# EasyEDA Pro project ProDoc_v03_CPU6502_4Plane.epro

# Schematic v03_CPU6502_4Plane
Board Name: v03_CPU6502_4Plane; Create Date: 2024-08-20; Page Name: v03_CPU6502_4Plane; Project Name: The20c_v03; Schematic Name: v03_CPU6502_4Plane; Update Date: 2024-09-03; Company: OsoLabs.tech; Drawn: OsoLabs; Page Size: A4; Part Number: v03_CPU6502_4Plane; Reviewed: OsoLabs; Version: V03
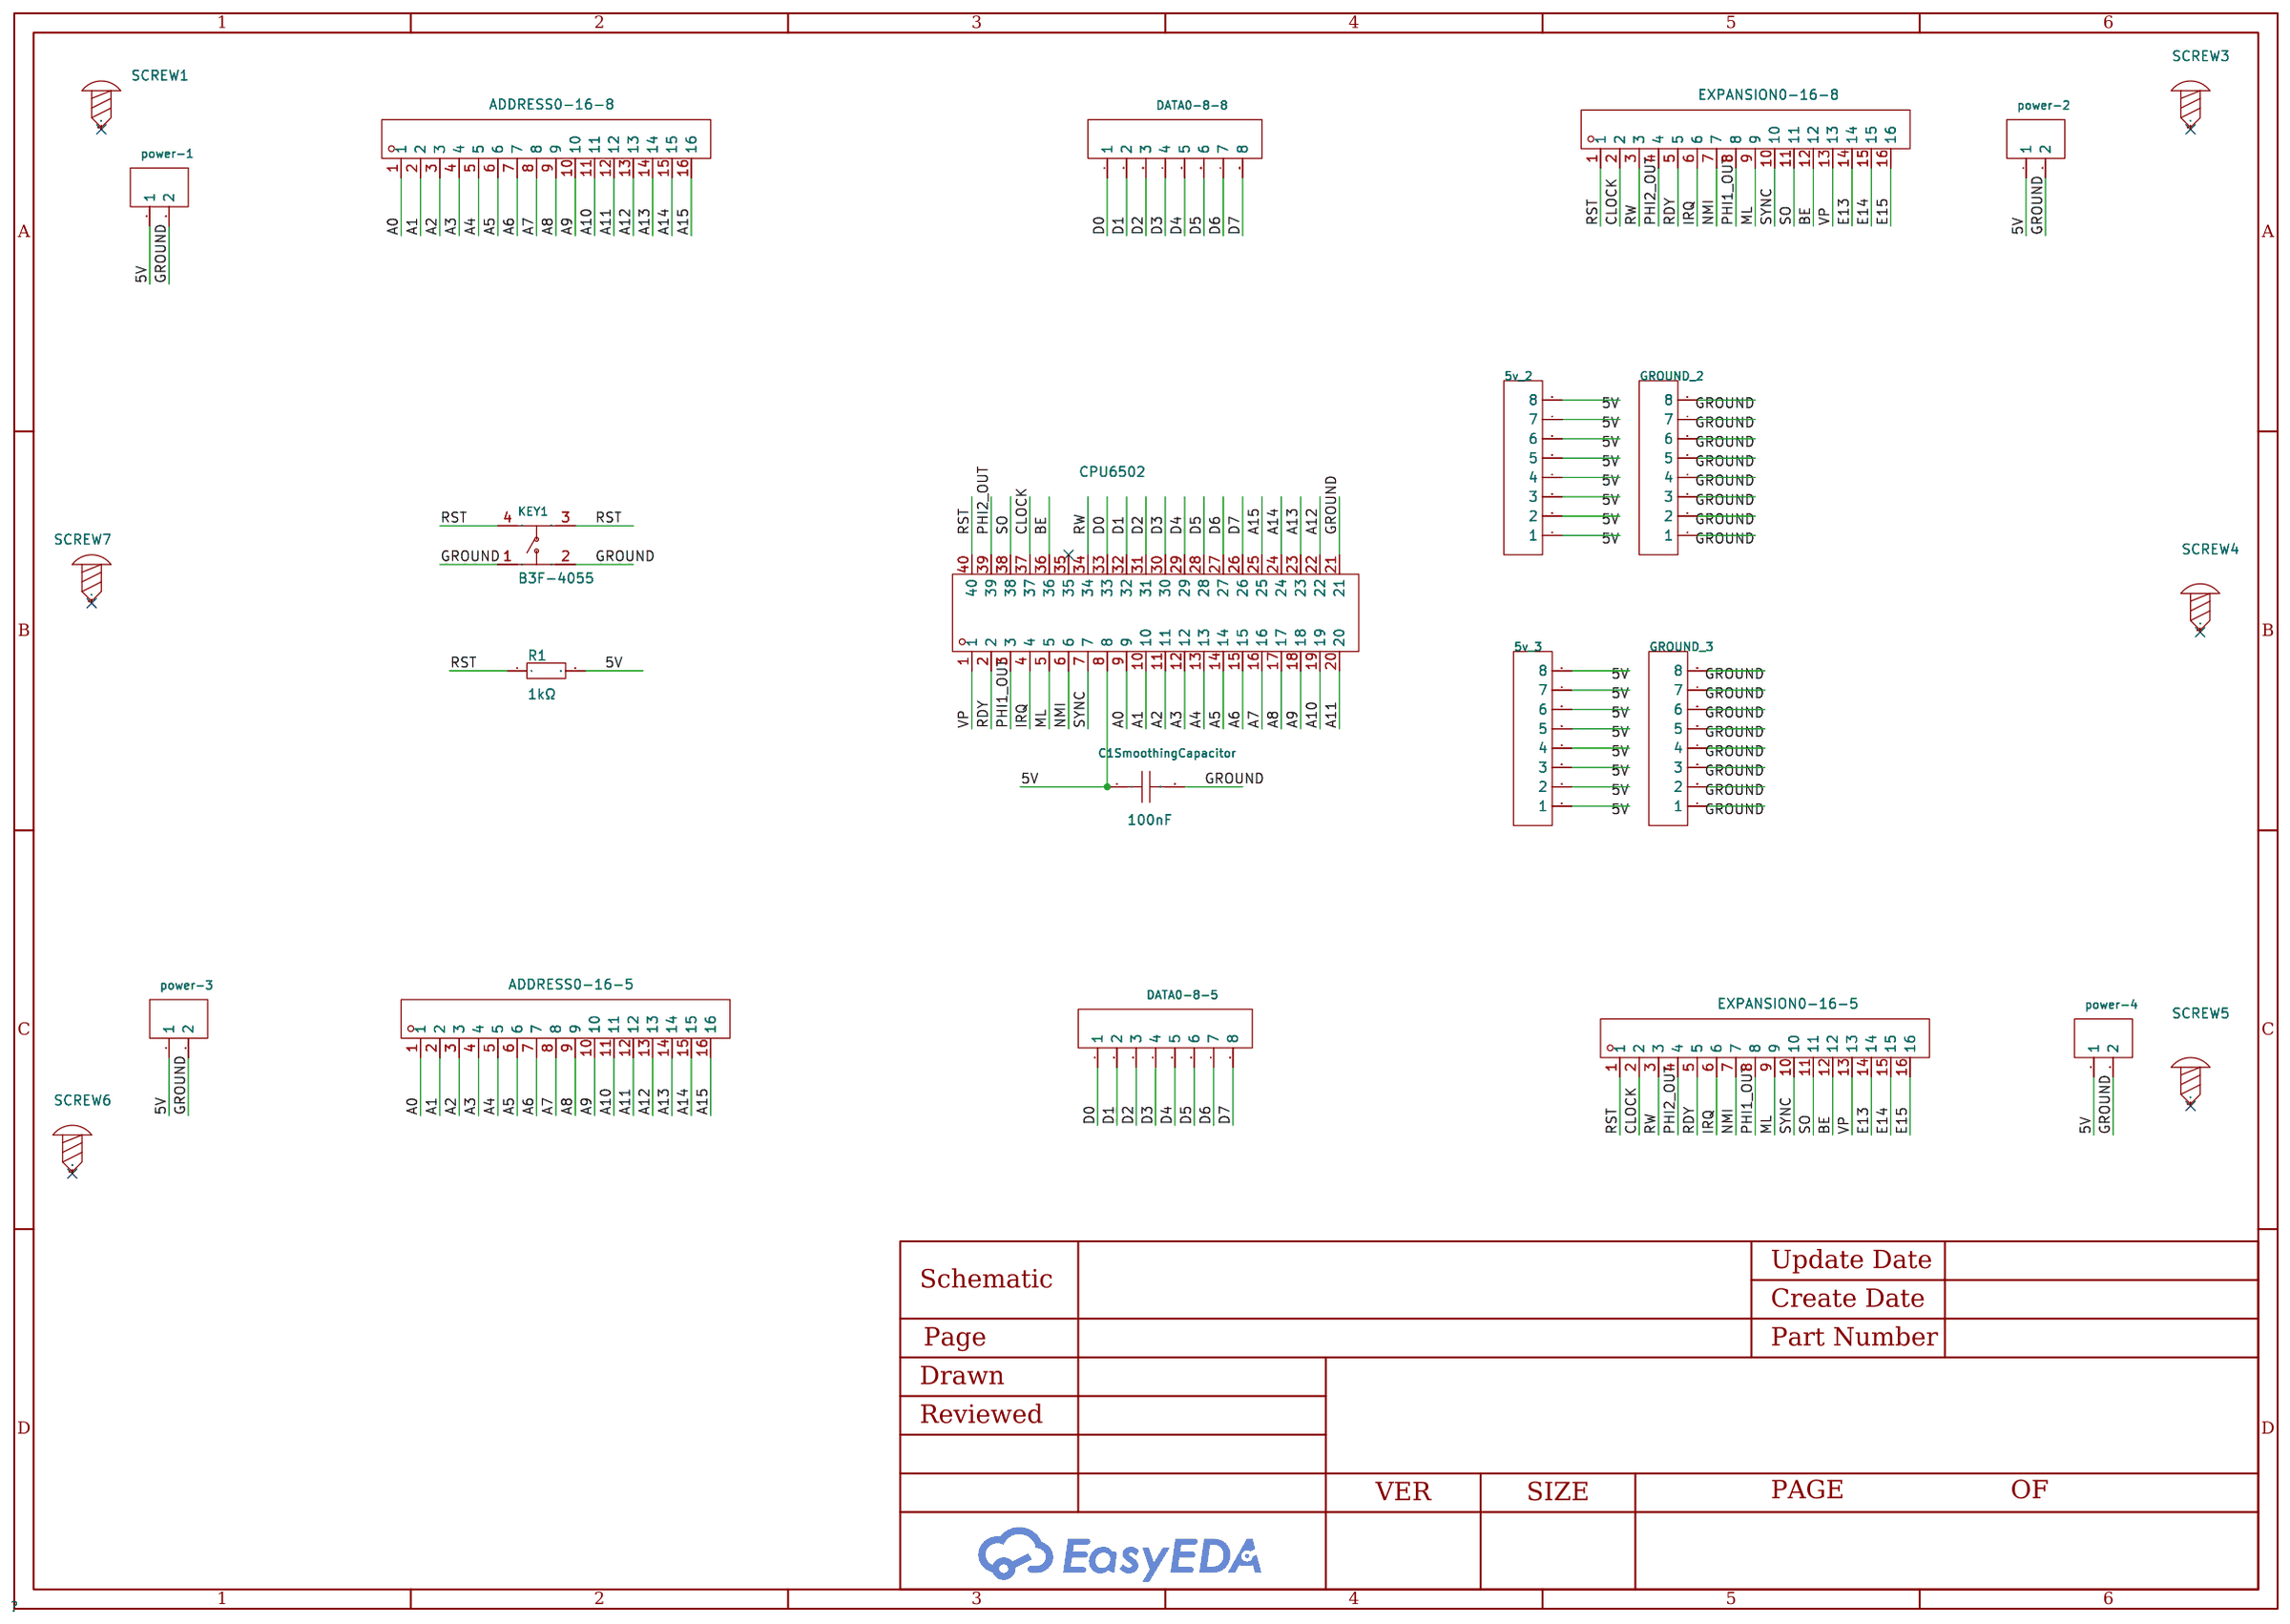
[diagram p0: schematic sheet]

## Parts
5v_2  2.54-1*8P母环保  [HDR-TH_8P-P2.54-V-F-1]
5v_3  2.54-1*8P母环保  [HDR-TH_8P-P2.54-V-F-1]
ADDRESS0-16-5  PM254-1-16-Z-8.5  [HDR-TH_16P-P2.54-V-F-A]
ADDRESS0-16-8  PM254-1-16-Z-8.5  [HDR-TH_16P-P2.54-V-F-A]
C1SmoothingCapacitor  100nF  [CAP-TH_L5.8-W2.4-P2.54-D0.6]
CPU6502  IC座-40P  [DIP-40_L50.8-W17.8-P2.54-LS15.2-BL]
DATA0-8-5  2.54-1*8P母环保  [HDR-TH_8P-P2.54-V-F-1]
DATA0-8-8  2.54-1*8P母环保  [HDR-TH_8P-P2.54-V-F-1]
EXPANSION0-16-5  PM254-1-16-Z-8.5  [HDR-TH_16P-P2.54-V-F-A]
EXPANSION0-16-8  PM254-1-16-Z-8.5  [HDR-TH_16P-P2.54-V-F-A]
GROUND_2  2.54-1*8P母环保  [HDR-TH_8P-P2.54-V-F-1]
GROUND_3  2.54-1*8P母环保  [HDR-TH_8P-P2.54-V-F-1]
KEY1  B3F-4055  [KEY-TH_4P-L12.0-W12.0-P5.00-LS13.4-EH]
power-1  2.54-1*2P母  [HDR-TH_2P-P2.54-V-F]
power-2  2.54-1*2P母  [HDR-TH_2P-P2.54-V-F]
power-3  2.54-1*2P母  [HDR-TH_2P-P2.54-V-F]
power-4  2.54-1*2P母  [HDR-TH_2P-P2.54-V-F]
R1  1kΩ  [RES-TH_BD2.7-L6.2-P10.20-D0.4]
SCREW1  -  [Screw-Hole-M3]
SCREW3  -  [Screw-Hole-M3]
SCREW4  -  [Screw-Hole-M3]
SCREW5  -  [Screw-Hole-M3]
SCREW6  -  [Screw-Hole-M3]
SCREW7  -  [Screw-Hole-M3]

## Library data of the parts
5v_2 5v_3 DATA0-8-5 DATA0-8-8 GROUND_2 GROUND_3 = 2.54-1*8P母环保: Holes Structure:1x8P Pitch:2.54mm Row Spacing:- Mounting Type:Straight Number of Rows:Plugin Number of Holes:8P Insulation Height:- Contact Material:- Contact Plating:-; LCSC Part Name: 间距:2.54mm 1x8P 直插; Supplier Part: C27438; Manufacturer: BOOMELE(博穆精密); Supplier Footprint: 插件,P=2.54mm; JLCPCB Part Class: Extended Part; Datasheet: https://atta.szlcsc.com/upload/public/pdf/source/20231221/1CA800C6799ED97958773716FAA1BFFE.pdf; Supplier: LCSC; Holes Structure: 1x8P; Pitch: 2.54mm; Mounting Type: Straight; Number of Rows: Plugin; Number of Holes: 8P
ADDRESS0-16-5 ADDRESS0-16-8 EXPANSION0-16-5 EXPANSION0-16-8 = PM254-1-16-Z-8.5: Holes Structure:1x16P Pitch:2.54mm Row Spacing:- Circular Hole / Square Hole:Square Holes Mounting Type:Straight Number of Rows:Plugin Number of Holes:16P Current Rating (Max):3A Voltage Rating (Max):- Holes Direction:Top Insulation Height:8.5mm Contact M; LCSC Part Name: 1x16P 间距:2.54mm 直插; Supplier Part: C2897379; Manufacturer: HCTL(华灿天禄); Supplier Footprint: 插件,P=2.54mm; JLCPCB Part Class: Extended Part; Datasheet: https://atta.szlcsc.com/upload/public/pdf/source/20230609/534BE42964C679BDE98E061007C4ABD6.pdf; Supplier: LCSC; Holes Structure: 1x16P; Pitch: 2.54mm; Circular Hole / Square Hole: Square Holes; Mounting Type: Straight; Number of Rows: Plugin; Number of Holes: 16P; Current Rating (Max): 3A; Holes Direction: Top; Insulation Height: 8.5mm; Contact Material: Copper Alloy; Operating Temperature Range: -40℃~+105℃; Soldering Temperature(Max): 260℃@5S
C1SmoothingCapacitor = CC1H104ZA1ED3F5P1100: Capacitance:100nF Tolerance:-20%~+80% Tolerance:-20%~+80% Voltage Rated: Lead Spacing: Temperature Coefficient: φD: Body Thickness:2.4mm; LCSC Part Name: 100nF -20%~+80% 50V; Supplier Part: C2832506; Manufacturer: Dersonic(德尔创); Supplier Footprint: 插件,P=2.54mm; JLCPCB Part Class: Extended Part; Datasheet: https://atta.szlcsc.com/upload/public/pdf/source/20211027/619020FDD8EBC9BBFCA73A5584FA164D.pdf; Supplier: LCSC; Tolerance: -20%~+80%; Body Thickness: 2.4mm
CPU6502 = IC座-40P: IC Type:DIP Pitch:2.54mm Row Spacing:15.24mm Number of Positions:40P Contact Plating:-; LCSC Part Name: 间距2.54mm P数:40P; Supplier Part: C2332; Manufacturer: BOOMELE(博穆精密); Supplier Footprint: DIP-40; JLCPCB Part Class: Extended Part; Datasheet: https://atta.szlcsc.com/upload/public/pdf/source/20151118/1457707579760.pdf; Supplier: LCSC; IC Type: DIP; Pitch: 2.54mm; Row Spacing: 15.24mm; Number of Positions: 40P
KEY1 = B3F-4055_C84931: Circuit:SPST Actuator Style:Rectangle button Mounting Style:Straight Switch Length:12mm Switch Width:12mm Switch Height:7.3mm Contact Current:50mA Voltage Rating (DC):24V With Lamp:- Mechanical Life:-; LCSC Part Name: 12*12*7.3mm 直插 轻触开关; Supplier Part: C84931; Manufacturer: OMRON(欧姆龙); Supplier Footprint: 插件; JLCPCB Part Class: Extended Part; Datasheet: https://atta.szlcsc.com/upload/public/pdf/source/20170810/C93157_1502335414592880008.pdf; Supplier: LCSC; Circuit: SPST; Actuator Style: Rectangle button; Mounting Style: Straight; Switch Length: 12mm; Switch Width: 12mm; Switch Height: 7.3mm; Contact Current: 50mA; Voltage Rating (DC): 24V
power-1-power-4 = 2.54-1*2P母: Holes Structure:1x2P Pitch:2.54mm Row Spacing:- Mounting Type:Straight Number of Rows:Plugin Number of Holes:2P Insulation Height:- Contact Material:- Contact Plating:-; LCSC Part Name: 间距:2.54mm 1x2P 直插; Supplier Part: C49661; Manufacturer: BOOMELE(博穆精密); Supplier Footprint: 插件,P=2.54mm; JLCPCB Part Class: Extended Part; Datasheet: https://atta.szlcsc.com/upload/public/pdf/source/20210301/C2718488_F4427B881E42CAA8DDB0B1C12B3A522C.pdf; Supplier: LCSC; Holes Structure: 1x2P; Pitch: 2.54mm; Mounting Type: Straight; Number of Rows: Plugin; Number of Holes: 2P
R1 = CR1/4W-1K±5%-ST26: Type:Carbon Resister Resistance: Tolerance:±5% Tolerance:±5% Overload Voltage (Max):250V Power(Watts):250mW Temperature Coefficient:±350ppm/℃ Temperature Coefficient:±350ppm/℃ Operating Temperature Range:-55℃~+155℃ Operating Temperature Range:-55℃~+155℃; LCSC Part Name: 碳膜电阻 1kΩ ±5% 250mW; Supplier Part: C2894606; Manufacturer: VO(翔胜); Supplier Footprint: 插件,2.7x6.2mm; JLCPCB Part Class: Extended Part; Datasheet: https://atta.szlcsc.com/upload/public/pdf/source/20210803/C2857407_45FF53FE186CAB545115AD37303966CD.pdf; Supplier: LCSC; Type: Carbon Resister; Tolerance: ±5%; Overload Voltage (Max): 250V; Power(Watts): 250mW; Temperature Coefficient: ±350ppm/℃; Operating Temperature Range: -55℃~+155℃
SCREW1 SCREW3-SCREW7 = Screw-Hole-M3: Supplier Footprint: 插件

## Nets
5V: 5v_2.1 5v_2.2 5v_2.3 5v_2.4 5v_2.5 5v_2.6 5v_2.7 5v_2.8 5v_3.1 5v_3.2 5v_3.3 5v_3.4 5v_3.5 5v_3.6 5v_3.7 5v_3.8 C1SmoothingCapacitor.1 CPU6502.8 power-1.1 power-2.1 power-3.1 power-4.1 R1.2
A0: ADDRESS0-16-5.1 ADDRESS0-16-8.1 CPU6502.9
A1: ADDRESS0-16-5.2 ADDRESS0-16-8.2 CPU6502.10
A2: ADDRESS0-16-5.3 ADDRESS0-16-8.3 CPU6502.11
A3: ADDRESS0-16-5.4 ADDRESS0-16-8.4 CPU6502.12
A4: ADDRESS0-16-5.5 ADDRESS0-16-8.5 CPU6502.13
A5: ADDRESS0-16-5.6 ADDRESS0-16-8.6 CPU6502.14
A6: ADDRESS0-16-5.7 ADDRESS0-16-8.7 CPU6502.15
A7: ADDRESS0-16-5.8 ADDRESS0-16-8.8 CPU6502.16
A8: ADDRESS0-16-5.9 ADDRESS0-16-8.9 CPU6502.17
A9: ADDRESS0-16-5.10 ADDRESS0-16-8.10 CPU6502.18
A10: ADDRESS0-16-5.11 ADDRESS0-16-8.11 CPU6502.19
A11: ADDRESS0-16-5.12 ADDRESS0-16-8.12 CPU6502.20
A12: ADDRESS0-16-5.13 ADDRESS0-16-8.13 CPU6502.22
A13: ADDRESS0-16-5.14 ADDRESS0-16-8.14 CPU6502.23
A14: ADDRESS0-16-5.15 ADDRESS0-16-8.15 CPU6502.24
A15: ADDRESS0-16-5.16 ADDRESS0-16-8.16 CPU6502.25
BE: CPU6502.36 EXPANSION0-16-5.12 EXPANSION0-16-8.12
CLOCK: CPU6502.37 EXPANSION0-16-5.2 EXPANSION0-16-8.2
D0: CPU6502.33 DATA0-8-5.1 DATA0-8-8.1
D1: CPU6502.32 DATA0-8-5.2 DATA0-8-8.2
D2: CPU6502.31 DATA0-8-5.3 DATA0-8-8.3
D3: CPU6502.30 DATA0-8-5.4 DATA0-8-8.4
D4: CPU6502.29 DATA0-8-5.5 DATA0-8-8.5
D5: CPU6502.28 DATA0-8-5.6 DATA0-8-8.6
D6: CPU6502.27 DATA0-8-5.7 DATA0-8-8.7
D7: CPU6502.26 DATA0-8-5.8 DATA0-8-8.8
E13: EXPANSION0-16-5.14 EXPANSION0-16-8.14
E14: EXPANSION0-16-5.15 EXPANSION0-16-8.15
E15: EXPANSION0-16-5.16 EXPANSION0-16-8.16
GROUND: C1SmoothingCapacitor.2 CPU6502.21 GROUND_2.1 GROUND_2.2 GROUND_2.3 GROUND_2.4 GROUND_2.5 GROUND_2.6 GROUND_2.7 GROUND_2.8 GROUND_3.1 GROUND_3.2 GROUND_3.3 GROUND_3.4 GROUND_3.5 GROUND_3.6 GROUND_3.7 GROUND_3.8 KEY1.1 KEY1.2 power-1.2 power-2.2 power-3.2 power-4.2
IRQ: CPU6502.4 EXPANSION0-16-5.6 EXPANSION0-16-8.6
ML: CPU6502.5 EXPANSION0-16-5.9 EXPANSION0-16-8.9
NMI: CPU6502.6 EXPANSION0-16-5.7 EXPANSION0-16-8.7
PHI1_OUT: CPU6502.3 EXPANSION0-16-5.8 EXPANSION0-16-8.8
PHI2_OUT: CPU6502.39 EXPANSION0-16-5.4 EXPANSION0-16-8.4
RDY: CPU6502.2 EXPANSION0-16-5.5 EXPANSION0-16-8.5
RST: CPU6502.40 EXPANSION0-16-5.1 EXPANSION0-16-8.1 KEY1.3 KEY1.4 R1.1
RW: CPU6502.34 EXPANSION0-16-5.3 EXPANSION0-16-8.3
SO: CPU6502.38 EXPANSION0-16-5.11 EXPANSION0-16-8.11
SYNC: CPU6502.7 EXPANSION0-16-5.10 EXPANSION0-16-8.10
VP: CPU6502.1 EXPANSION0-16-5.13 EXPANSION0-16-8.13

Not connected (* = marked no-connect by the designer): CPU6502 35*; SCREW1 1*; SCREW3 1*; SCREW4 1*; SCREW5 1*; SCREW6 1*; SCREW7 1*

# Board v03_CPU6502_4Plane
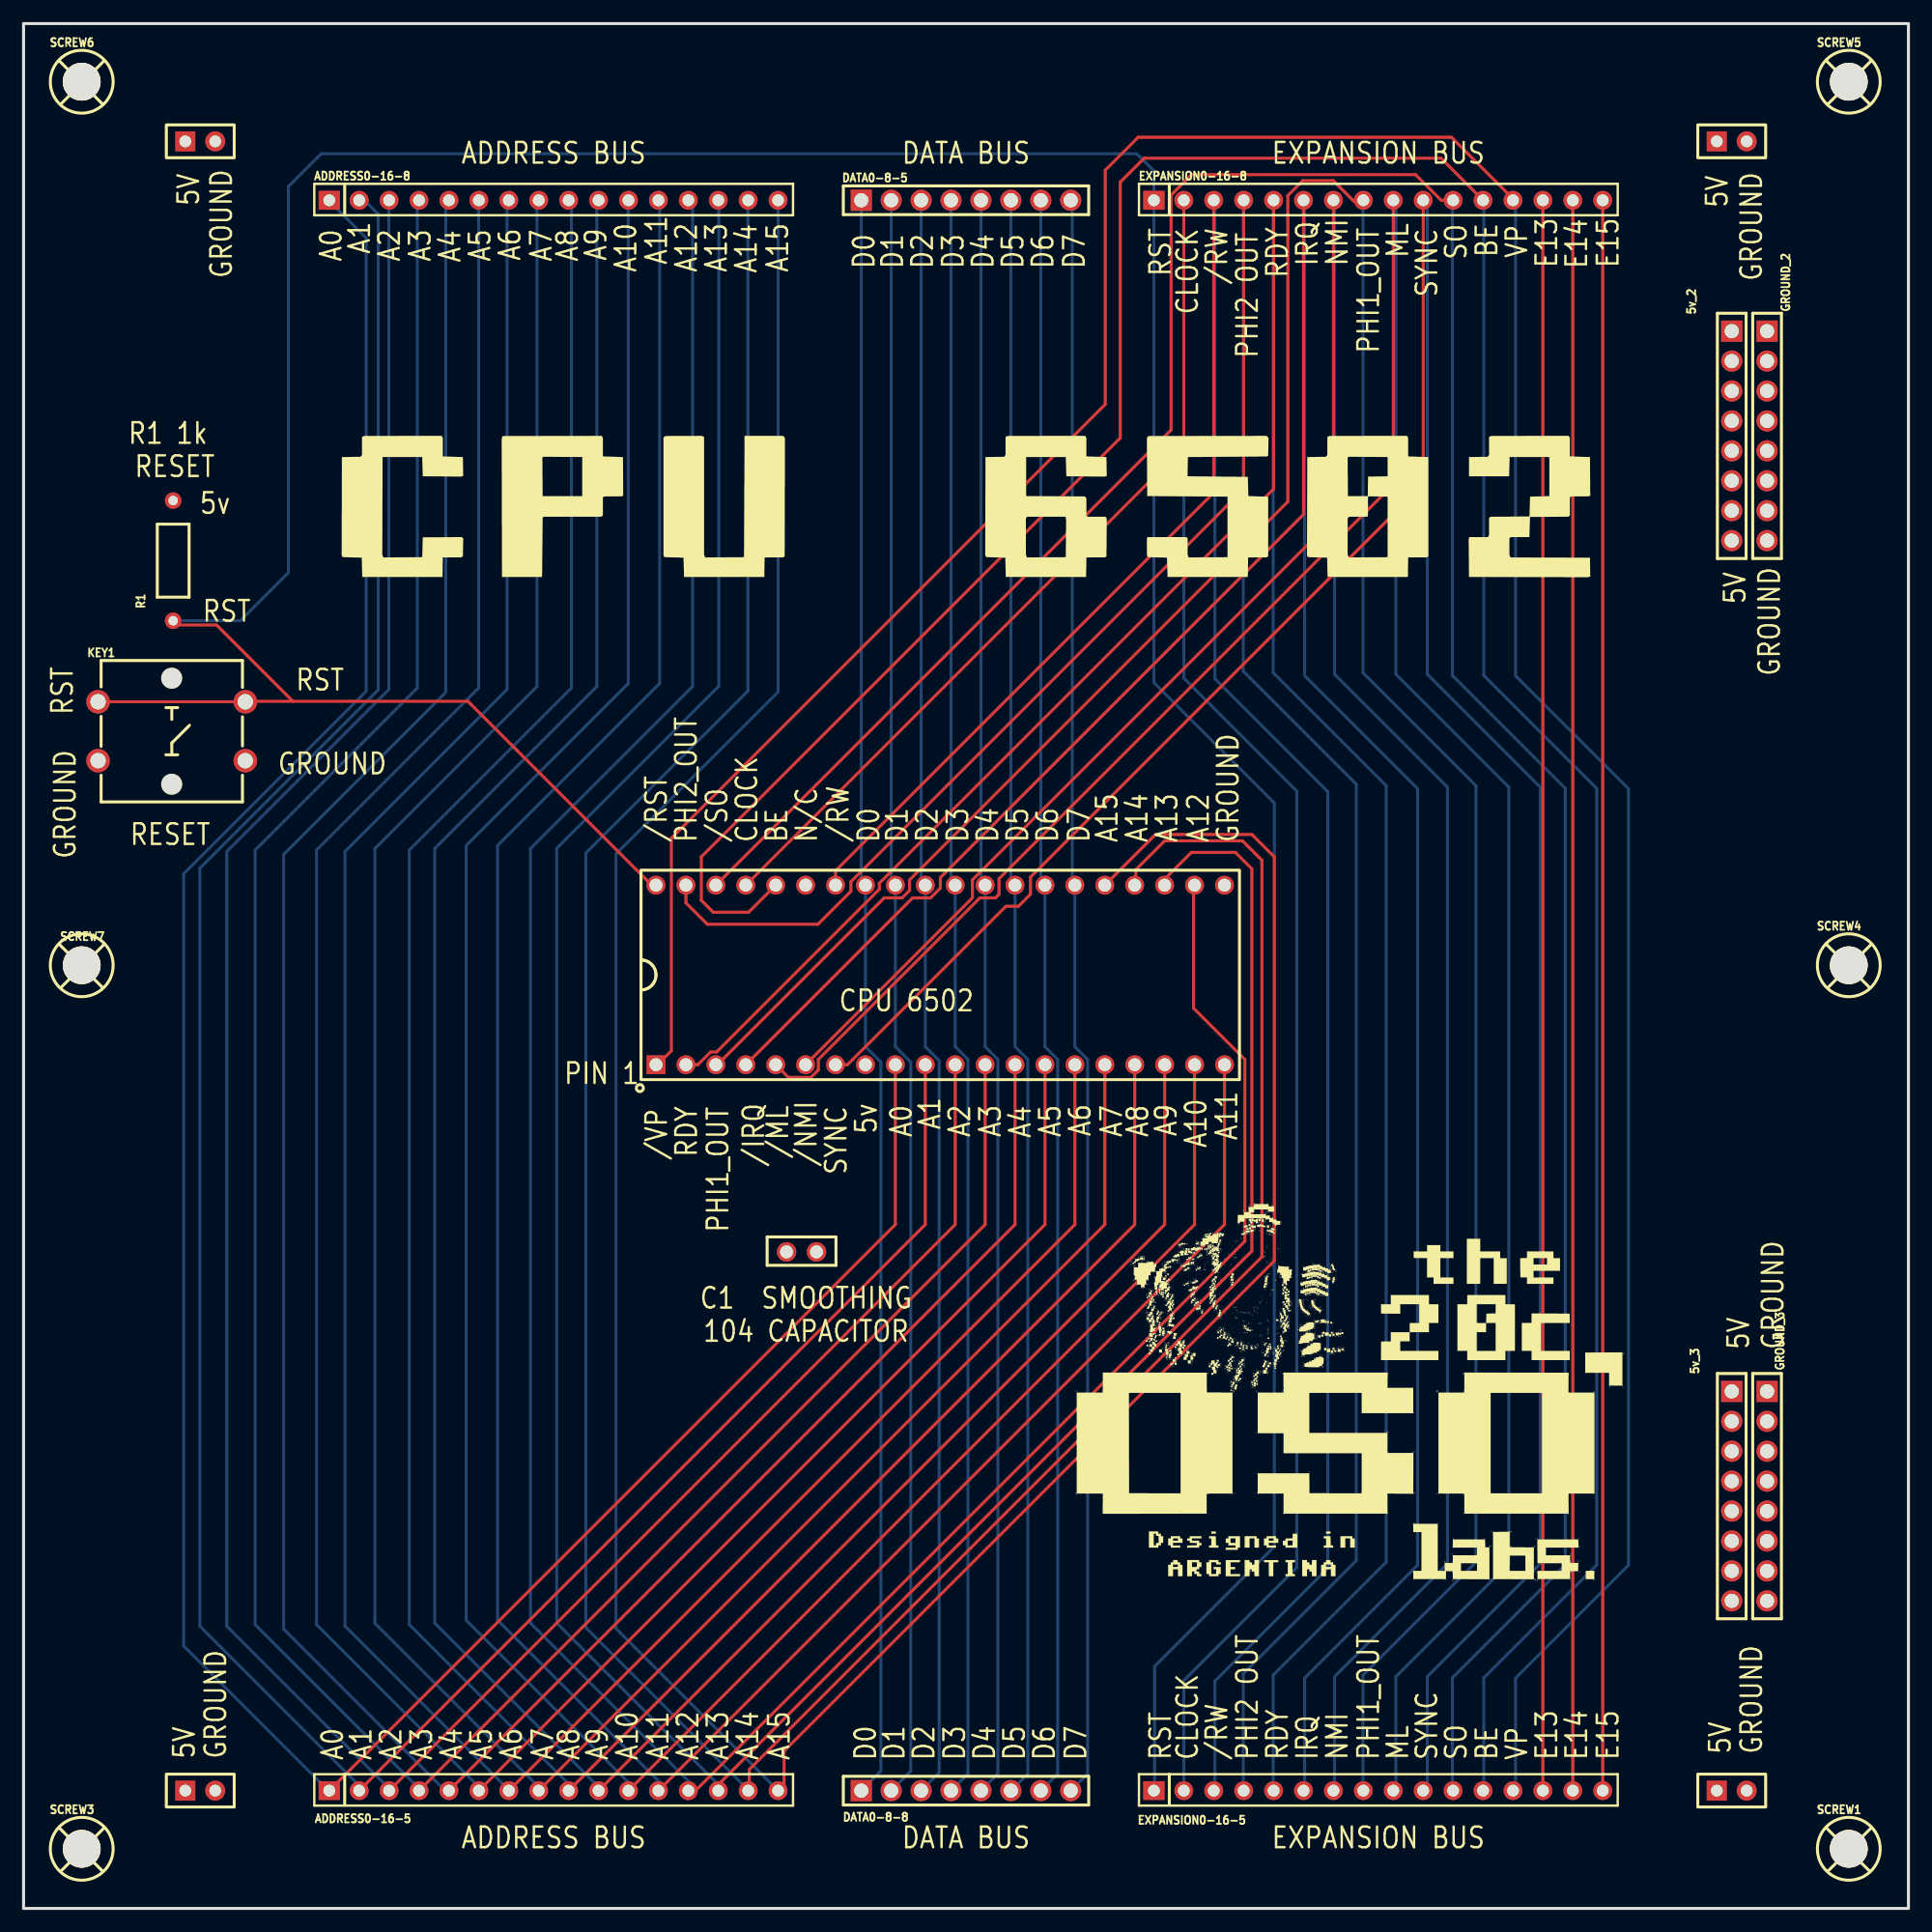
[diagram p1: board, top side]
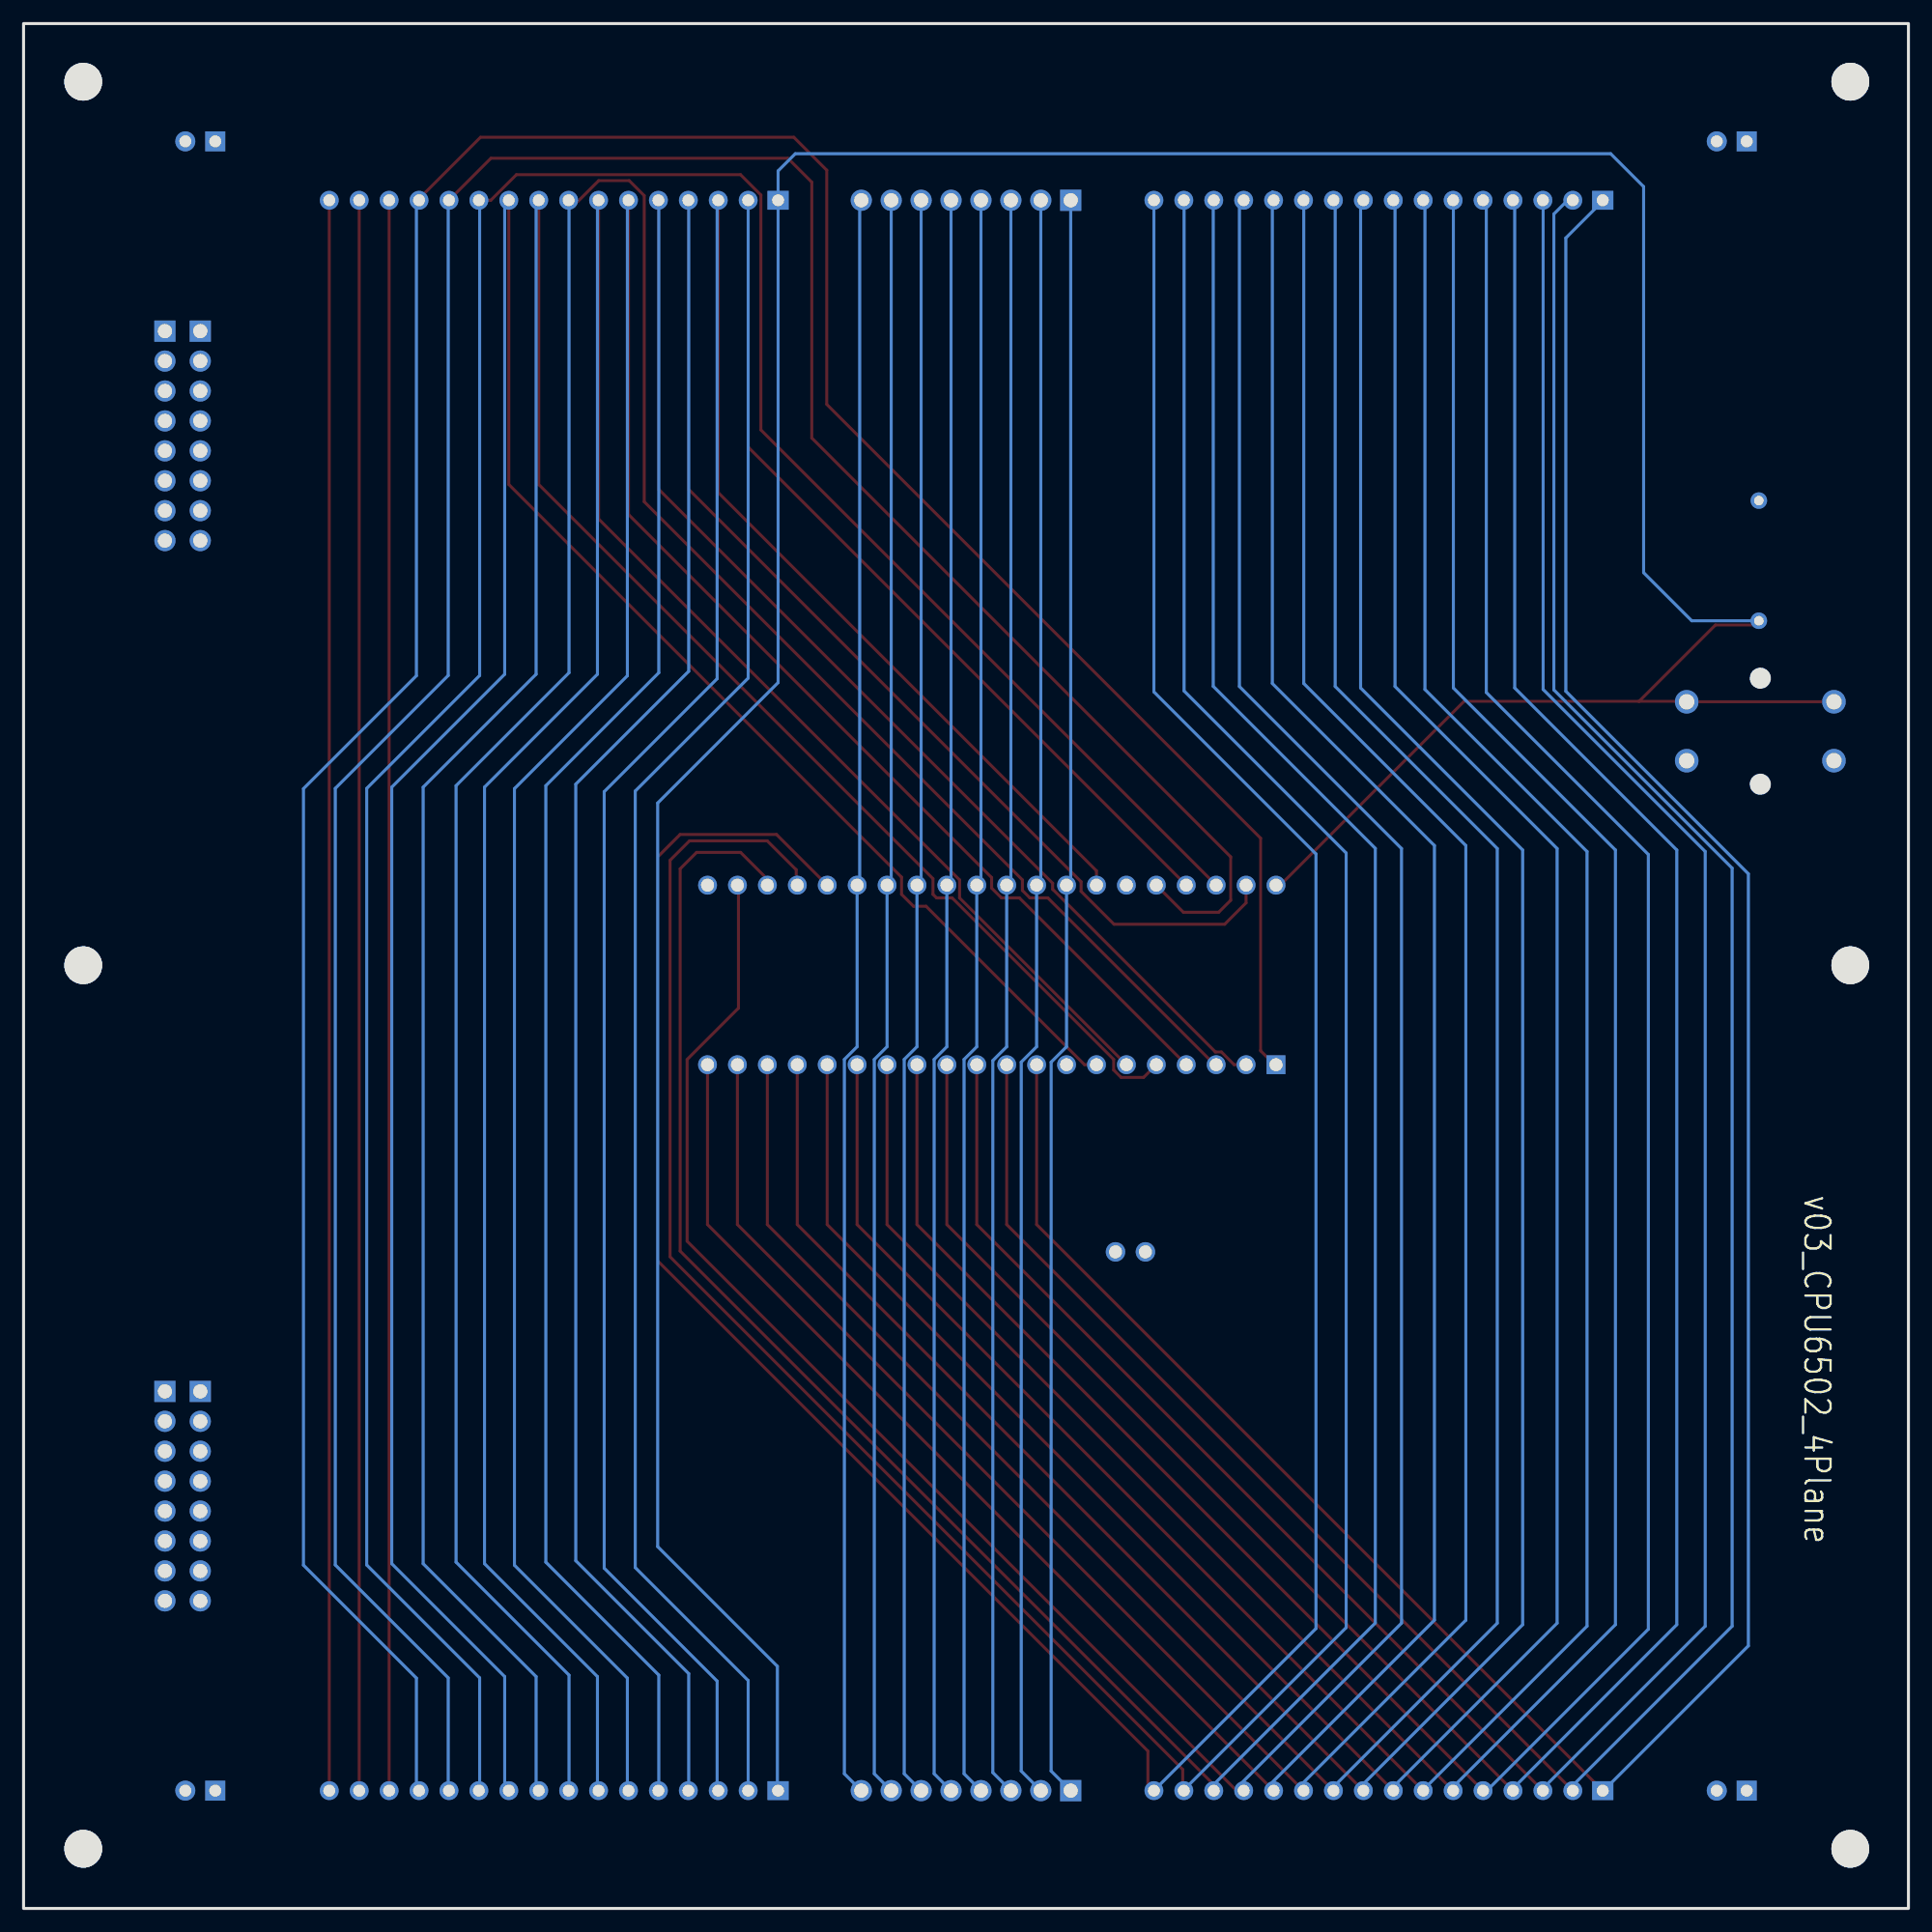
[diagram p2: board, bottom side, seen from below]

Outline 160 x 160 mm; copper layers: Top Layer, GROUND, 5V, Bottom Layer. Coordinates in mm from the lower left corner of the outline.
Outline path: rectangle 0,160 160,0
Stack: Top Layer 0.035mm 外层铜厚1oz / Dielectric1 0.2104mm 7628 RC49% 8.6mil / GROUND 0.0152mm 内层铜厚 / Dielectric2 1.065mm 1.1mm H/HOZ 含铜 / 5V 0.0152mm 内层铜厚 / Dielectric3 0.2104mm 7628 RC49% 8.6mil / Bottom Layer 0.035mm 外层铜厚1oz

## Design rules (mm)
template: Custom Config
spacing copperThickness1oz (default): track to track 0.102, other pairs 0.152 to 0.3
spacing copperThickness2oz: track to track 0.203, other pairs 0.152 to 0.3
track width copperThickness1oz (default): min 0.127, default 0.254, max 2.54
track width copperThickness2oz: min 0.203, default 0.254, max 2.54
differential pair differentialPair (default): width min 0.127, default 0.254, max 2.54; gap min 0.152, default 0.152
via viaSize (default): diameter min 0.5, default 0.61, max 10; hole min 0.3, default 0.305, max 6.299
net 5V uses 5VPlane

## Placement (name value [footprint] x y rotation side)
5v_2  2.54-1*8P母环保  [HDR-TH_8P-P2.54-V-F-1]  145 125 270 top
5v_3  2.54-1*8P母环保  [HDR-TH_8P-P2.54-V-F-1]  145 35 270 top
ADDRESS0-16-5  PM254-1-16-Z-8.5  [HDR-TH_16P-P2.54-V-F-A]  45 10 0 top
ADDRESS0-16-8  PM254-1-16-Z-8.5  [HDR-TH_16P-P2.54-V-F-A]  45 145 0 top
C1SmoothingCapacitor  100nF  [CAP-TH_L5.8-W2.4-P2.54-D0.6]  66.04 55.73 180 top
CPU6502  IC座-40P  [DIP-40_L50.8-W17.8-P2.54-LS15.2-BL]  77.81 79.24 0 top
DATA0-8-5  2.54-1*8P母环保  [HDR-TH_8P-P2.54-V-F-1]  80 145 0 top
DATA0-8-8  2.54-1*8P母环保  [HDR-TH_8P-P2.54-V-F-1]  80 10 0 top
EXPANSION0-16-5  PM254-1-16-Z-8.5  [HDR-TH_16P-P2.54-V-F-A]  115 10 0 top
EXPANSION0-16-8  PM254-1-16-Z-8.5  [HDR-TH_16P-P2.54-V-F-A]  115 145 0 top
GROUND_2  2.54-1*8P母环保  [HDR-TH_8P-P2.54-V-F-1]  148 125 270 top
GROUND_3  2.54-1*8P母环保  [HDR-TH_8P-P2.54-V-F-1]  148 35 270 top
KEY1  B3F-4055  [KEY-TH_4P-L12.0-W12.0-P5.00-LS13.4-EH]  12.57 99.93 0 top
power-1  2.54-1*2P母  [HDR-TH_2P-P2.54-V-F]  15 150 0 top
power-2  2.54-1*2P母  [HDR-TH_2P-P2.54-V-F]  145 150 0 top
power-3  2.54-1*2P母  [HDR-TH_2P-P2.54-V-F]  15 10 0 top
power-4  2.54-1*2P母  [HDR-TH_2P-P2.54-V-F]  145 10 0 top
R1  1kΩ  [RES-TH_BD2.7-L6.2-P10.20-D0.4]  12.7 114.41 90 top
SCREW1  -  [Screw-Hole-M3]  155 5 0 top
SCREW3  -  [Screw-Hole-M3]  5 5 0 top
SCREW4  -  [Screw-Hole-M3]  155 80 0 top
SCREW5  -  [Screw-Hole-M3]  155 155 0 top
SCREW6  -  [Screw-Hole-M3]  5 155 0 top
SCREW7  -  [Screw-Hole-M3]  5 80 0 top

## Footprints (pads in the part's own frame, mm; a bottom-side part is the same pattern mirrored in y, then rotated)
CAP-TH_L5.8-W2.4-P2.54-D0.6
  round 1.65 hole 1.1: 1(-1.27,0) 2(1.27,0)
DIP-40_L50.8-W17.8-P2.54-LS15.2-BL
  rect 1.6x1.6 hole 1.1: 1(-24.13,-7.62)
  round 1.6 hole 1.1: 2(-21.59,-7.62) 3(-19.05,-7.62) 4(-16.51,-7.62) 5(-13.97,-7.62) 6(-11.43,-7.62) 7(-8.89,-7.62) 8(-6.35,-7.62) 9(-3.81,-7.62) 10(-1.27,-7.62) 11(1.27,-7.62) 12(3.81,-7.62) 13(6.35,-7.62) 14(8.89,-7.62) 15(11.43,-7.62) 16(13.97,-7.62) 17(16.51,-7.62) 18(19.05,-7.62) 19(21.59,-7.62) 20(24.13,-7.62) 21(24.125,7.62) 22(21.587,7.62) 23(19.045,7.62) 24(16.505,7.62) 25(13.965,7.62) 26(11.425,7.62) 27(8.885,7.62) 28(6.345,7.62) 29(3.81,7.62) 30(1.27,7.62) 31(-1.27,7.62) 32(-3.81,7.62) 33(-6.35,7.62) 34(-8.89,7.62) 35(-11.43,7.62) 36(-13.97,7.62) 37(-16.51,7.62) 38(-19.05,7.62) 39(-21.59,7.62) 40(-24.13,7.62)
HDR-TH_2P-P2.54-V-F
  rect 1.7x1.7 hole 1: 1(-1.27,0)
  round 1.7 hole 1: 2(1.27,0)
HDR-TH_8P-P2.54-V-F-1
  rect 1.8x1.8 hole 1.2: 1(-8.89,0)
  round 1.8 hole 1.2: 2(-6.35,0) 3(-3.81,0) 4(-1.27,0) 5(1.27,0) 6(3.81,0) 7(6.35,0) 8(8.89,0)
HDR-TH_16P-P2.54-V-F-A
  rect 1.8x1.6 hole 1: 1(-19.05,0)
  round 1.6 hole 1: 2(-16.51,0) 3(-13.97,0) 4(-11.43,0) 5(-8.89,0) 6(-6.35,0) 7(-3.81,0) 8(-1.27,0) 9(1.27,0) 10(3.81,0) 11(6.35,0) 12(8.89,0) 13(11.43,0) 14(13.97,0) 15(16.51,0) 16(19.05,0)
KEY-TH_4P-L12.0-W12.0-P5.00-LS13.4-EH
  round 2 hole 1.3: 1(6.25,-2.5) 2(-6.25,-2.5) 3(6.25,2.5) 4(-6.25,2.5)
RES-TH_BD2.7-L6.2-P10.20-D0.4
  round 1.4 hole 0.8: 1(-5.1,0) 2(5.1,0)
Screw-Hole-M3
  round 3.2 hole 3.2: 1(-0.064,0.064)

## Nets
As in the schematic.

Pads without a net: CPU6502 35; SCREW1 1; SCREW3 1; SCREW4 1; SCREW5 1; SCREW6 1; SCREW7 1

## Routing (per net, layer and track width the routed paths; a pad name or vN(x,y) marks a point on that pad's centre or on a via; arc(x,y) is an arc through that point)
A0: length 229.4
  Top Layer w0.254: CPU6502.9 74,58.05 ADDRESS0-16-5.1
  Bottom Layer w0.254: 25.93,144.95 29.08,141.8 29.08,103.32 13.59,87.83 13.59,22.29 25.93,9.95
A1: length 229.1
  Top Layer w0.254: CPU6502.10 76.54,58.05 ADDRESS0-16-5.2
  Bottom Layer w0.254: 28.72,145.2 30.1,143.83 30.1,103.44 14.97,88.31 14.97,23.96 28.72,10.2
A2: length 227.9
  Top Layer w0.254: CPU6502.11 79.08,58.05 ADDRESS0-16-5.3
  Bottom Layer w0.254: 31.01,145.2 31.01,103.48 17.25,89.72 17.25,23.96 31.01,10.2
A3: length 227.9
  Top Layer w0.254: ADDRESS0-16-5.4 81.62,58.05 CPU6502.12
  Bottom Layer w0.254: 33.42,145.33 33.42,103.6 19.66,89.85 19.66,24.09 33.42,10.33
A4: length 227.9
  Top Layer w0.254: ADDRESS0-16-5.5 84.16,58.05 CPU6502.13
  Bottom Layer w0.254: 35.83,144.95 35.83,103.22 22.08,89.47 22.08,23.71 35.83,9.95
A5: length 227.6
  Top Layer w0.254: ADDRESS0-16-5.6 86.7,58.05 CPU6502.14
  Bottom Layer w0.254: ADDRESS0-16-8.6 38.63,144.98 38.63,103.6 24.87,89.85 24.87,24.09 38.63,10.33
A6: length 227.9
  Top Layer w0.254: CPU6502.15 89.24,58.05 ADDRESS0-16-5.7
  Bottom Layer w0.254: 41.04,10.2 27.28,23.96 27.28,89.72 41.04,103.48 41.04,145.2
A7: length 227.9
  Top Layer w0.254: ADDRESS0-16-5.8 91.78,58.05 CPU6502.16
  Bottom Layer w0.254: 43.58,10.46 29.82,24.22 29.82,89.97 43.58,103.73 43.58,145.46
A8: length 227.9
  Top Layer w0.254: CPU6502.17 94.32,58.05 ADDRESS0-16-5.9
  Bottom Layer w0.254: 46.5,145.33 46.5,103.6 32.75,89.85 32.75,24.09 46.5,10.33
A9: length 227.9
  Top Layer w0.254: ADDRESS0-16-5.10 96.86,58.05 CPU6502.18
  Bottom Layer w0.254: 48.66,10.46 34.9,24.22 34.9,89.97 48.66,103.73 48.66,145.46
A10: length 227.9
  Top Layer w0.254: ADDRESS0-16-5.11 99.4,58.05 CPU6502.19
  Bottom Layer w0.254: 51.33,145.71 51.33,103.98 37.57,90.23 37.57,24.47 51.33,10.71
A11: length 227.9
  Top Layer w0.254: CPU6502.20 101.94,58.05 ADDRESS0-16-5.12
  Bottom Layer w0.254: 54,145.71 54,103.98 40.24,90.23 40.24,24.47 54,10.71
A12: length 244.7
  Top Layer w0.254: 56.34,9.31 103.67,56.64 103.67,72.06 99.31,76.42 99.31,86.17
  Bottom Layer w0.254: 56.79,145.46 56.79,103.73 43.03,89.97 43.03,24.22 56.79,10.46
A13: length 252.2
  Top Layer w0.254: 58.84,10.38 104.27,55.81 104.27,88.25 102.87,89.64 99.13,89.64 96.73,87.24
  Bottom Layer w0.254: 59.01,10.47 45.26,24.23 45.26,89.99 59.01,103.74 59.01,145.47
A14: length 255.8
  Top Layer w0.254: 94.41,87.46 94.41,88.17 96.87,90.62 103.47,90.62 105.12,88.97 105.12,55.32 61.6,11.8 61.6,10.6
  Bottom Layer w0.254: 61.49,10.08 47.73,23.84 47.73,89.59 61.49,103.35 61.49,144.98 ADDRESS0-16-8.15
A15: length 258.6
  Top Layer w0.254: 92.29,87.37 96.08,91.17 104.27,91.17 106.17,89.26 106.17,54.97 64.56,13.36 64.56,10.51
  Bottom Layer w0.254: ADDRESS0-16-8.16 64.05,103.27 50.29,89.52 50.29,23.76 ADDRESS0-16-5.16
BE: length 259.4
  Top Layer w0.254: CPU6502.36 61.54,84.56 58.55,84.56 57.53,85.58 57.53,89.26 93.09,124.82 93.09,146.54 95.12,148.57 120.32,148.57 EXPANSION0-16-8.12
  Bottom Layer w0.254: 123.95,10.22 123.95,19.57 133.54,29.16 133.54,95.07 123.95,104.66 123.95,145.22
CLOCK: length 216.5
  Top Layer w0.254: CPU6502.37 98.49,124.05 EXPANSION0-16-8.2
  Bottom Layer w0.254: EXPANSION0-16-5.2 98.49,19.35 108.08,28.94 108.08,94.85 98.49,104.44 EXPANSION0-16-8.2
D0: length 136.4
  Bottom Layer w0.254: DATA0-8-5.1 71.11,87.22 CPU6502.33 71.46,73.15 72.77,71.84 72.77,11.66 DATA0-8-8.1
D1: length 136.4
  Bottom Layer w0.254: DATA0-8-8.2 75.31,11.66 75.31,71.84 74,73.15 CPU6502.32 73.65,87.22 DATA0-8-5.2
D2: length 136.3
  Bottom Layer w0.254: DATA0-8-8.3 77.72,11.53 77.72,71.97 76.54,73.15 CPU6502.31 76.19,87.22 DATA0-8-5.3
D3: length 136.2
  Bottom Layer w0.254: DATA0-8-8.4 80.16,11.43 80.16,72.07 79.08,73.15 CPU6502.30 78.73,87.22 DATA0-8-5.4
D4: length 136.2
  Bottom Layer w0.254: DATA0-8-5.5 81.27,87.22 CPU6502.29 81.62,73.15 82.7,72.07 82.7,11.43 DATA0-8-8.5
D5: length 136.2
  Bottom Layer w0.254: DATA0-8-5.6 83.81,87.21 CPU6502.28 84.16,73.15 85.24,72.07 85.24,11.43 DATA0-8-8.6
D6: length 136.2
  Bottom Layer w0.254: DATA0-8-5.7 86.35,87.21 CPU6502.27 86.7,73.15 87.78,72.07 87.78,11.43 DATA0-8-8.7
D7: length 136.3
  Bottom Layer w0.254: 89.49,86.86 89.02,87.33 89.02,144.88 89.14,145 ; CPU6502.26 89.24,73.15 90.32,72.07 90.32,11.43 DATA0-8-8.8
E13: length 135
  Top Layer w0.254: EXPANSION0-16-8.14 EXPANSION0-16-5.14
E14: length 135
  Top Layer w0.254: EXPANSION0-16-5.15 EXPANSION0-16-8.15
E15: length 135
  Top Layer w0.254: EXPANSION0-16-8.16 EXPANSION0-16-5.16
IRQ: length 236.8
  Top Layer w0.254: CPU6502.4 75.47,85.78 76.99,85.78 77.83,86.62 77.83,87.51 108.65,118.33 EXPANSION0-16-8.6
  Bottom Layer w0.254: 108.74,145.2 108.74,104.64 118.33,95.05 118.33,29.14 108.74,19.55 108.74,10.2
ML: length 242.1
  Top Layer w0.254: EXPANSION0-16-8.9 116.27,120.87 82.8,87.41 82.8,86.09 82.5,85.78 81.18,85.78 67.46,72.07 67.46,71.17 66.83,70.54 64.92,70.54 CPU6502.5
  Bottom Layer w0.254: 116.49,145.33 116.49,104.77 126.08,95.18 126.08,29.27 116.49,19.68 116.49,10.33
NMI: length 234.9
  Top Layer w0.254: CPU6502.6 80.54,85.78 80.54,87.31 111.19,117.95 EXPANSION0-16-8.7
  Bottom Layer w0.254: 111.28,10.33 111.28,19.68 120.87,29.27 120.87,95.18 111.28,104.77 111.28,145.33
PHI1_OUT: length 243.9
  Top Layer w0.254: 58.89,71.62 73.05,85.78 74.58,85.78 75.21,86.41 75.21,87.31 107.31,119.41 107.31,145.4 108.59,146.66 111.18,146.66 112.96,144.89
  Bottom Layer w0.254: 113.7,144.76 113.7,104.89 123.28,95.31 123.28,29.39 113.7,19.81 113.7,10.46
PHI2_OUT: length 232.8
  Top Layer w0.254: EXPANSION0-16-8.4 103.57,120.49 70.23,87.15 70.23,86.34 67.44,83.55 58.04,83.55 56.22,85.36 CPU6502.39
  Bottom Layer w0.254: 103.54,145.59 103.54,105.02 113.12,95.43 113.12,29.52 103.54,19.93 103.54,10.59
RDY: length 237.9
  Top Layer w0.254: CPU6502.2 57.24,71.62 58.32,72.7 58.83,72.7 72.64,86.51 72.64,87.03 106.11,120.49 EXPANSION0-16-8.5
  Bottom Layer w0.254: 106.08,145.46 106.08,104.89 115.66,95.31 115.66,29.39 106.08,19.81 106.08,10.46
RST: length 332.3
  Top Layer w0.254: 22.86,102.47 18.86,102.47 KEY1.3 KEY1.4 ; 22.86,102.47 37.72,102.47 53.33,86.86 CPU6502.40 ; 22.86,102.47 16.38,108.95 13.06,108.95 R1.1
  Bottom Layer w0.254: R1.1 18.39,109.31 22.48,113.39 22.48,146.16 25.27,148.95 94.49,148.95 95.95,147.49 EXPANSION0-16-8.1 95.95,104.06 106.17,93.83 106.17,30.71 96.01,20.55 96.01,10.06 EXPANSION0-16-5.1
RW: length 214.4
  Top Layer w0.254: CPU6502.34 68.92,88.08 101.03,120.19 EXPANSION0-16-8.3
  Bottom Layer w0.254: 101.12,144.95 101.12,104.39 110.71,94.8 110.71,28.89 101.12,19.3 101.12,9.95
SO: length 243.1
  Top Layer w0.254: CPU6502.38 97.41,125.51 97.41,145.45 99.14,147.17 118.16,147.17 120.34,145 EXPANSION0-16-8.11
  Bottom Layer w0.254: 121.28,10.22 121.28,19.57 130.87,29.16 130.87,95.07 121.28,104.66 121.28,145.22
SYNC: length 238.2
  Top Layer w0.254: CPU6502.7 69.94,71.62 83.39,85.07 84.46,85.07 85.47,86.09 85.47,87.54 118.81,120.88 EXPANSION0-16-8.10
  Bottom Layer w0.254: 119.16,10.33 119.16,19.68 128.75,29.27 128.75,95.18 119.16,104.77 119.16,145.33
VP: length 272.7
  Top Layer w0.254: 53.81,71.62 54.99,72.8 54.99,90.85 91.82,127.68 91.82,147.55 94.62,150.35 121.21,150.35 126.56,145
  Bottom Layer w0.254: 126.65,145.2 126.65,104.64 136.24,95.05 136.24,29.14 126.65,19.55 126.65,10.2

## Copper pours and planes (outline as drawn; the poured copper is in the pictures)
5V on 5V: 2,158 158,158 158,2 2,2
GROUND on GROUND: 0.26,159.74 159.74,159.74 159.74,0.26 0.26,0.26

Small or netless copper shapes (teardrops, artwork), in the pictures only: 96 on GROUND, 92 on 5V

## Text on the board
Bottom Silkscreen Layer: v03_CPU6502_4Plane
Top Silkscreen Layer: A0 | A1 | A2 | A8 | A9 | A10 | D0 | D1 | D2 | RST | CLOCK | /RW | ML | SYNC | SO | RESET | R1 1k / RESET | ADDRESS BUS | DATA BUS | EXPANSION BUS | /RST | PHI2_OUT | /ML | /NMI | C1  SMOOTHING / 104 CAPACITOR | CPU 6502 | 5V | GROUND | A3 | A4 | A5 | A6 | A7 | A11 | A12 | A13 | A14 | A15 | D3 | D4 | D5 | D6 | D7 | PHI2 OUT | RDY | IRQ | NMI | PHI1_OUT | BE | VP | E13 | E14 | E15 | /VP | /SO | /IRQ | N/C | 5v | PIN 1
